# EasyEDA Pro project ProPrj_初级项目_2026-01-11.epro, schematic Schematic2
Board Name: Board2; Create Date: 2025-11-05; Page Name: P1; Project Name: 初级项目; Schematic Name: Schematic2; Update Date: 2025-12-01; Company: 嘉立创EDA; Page Size: A4; Version: V1.0
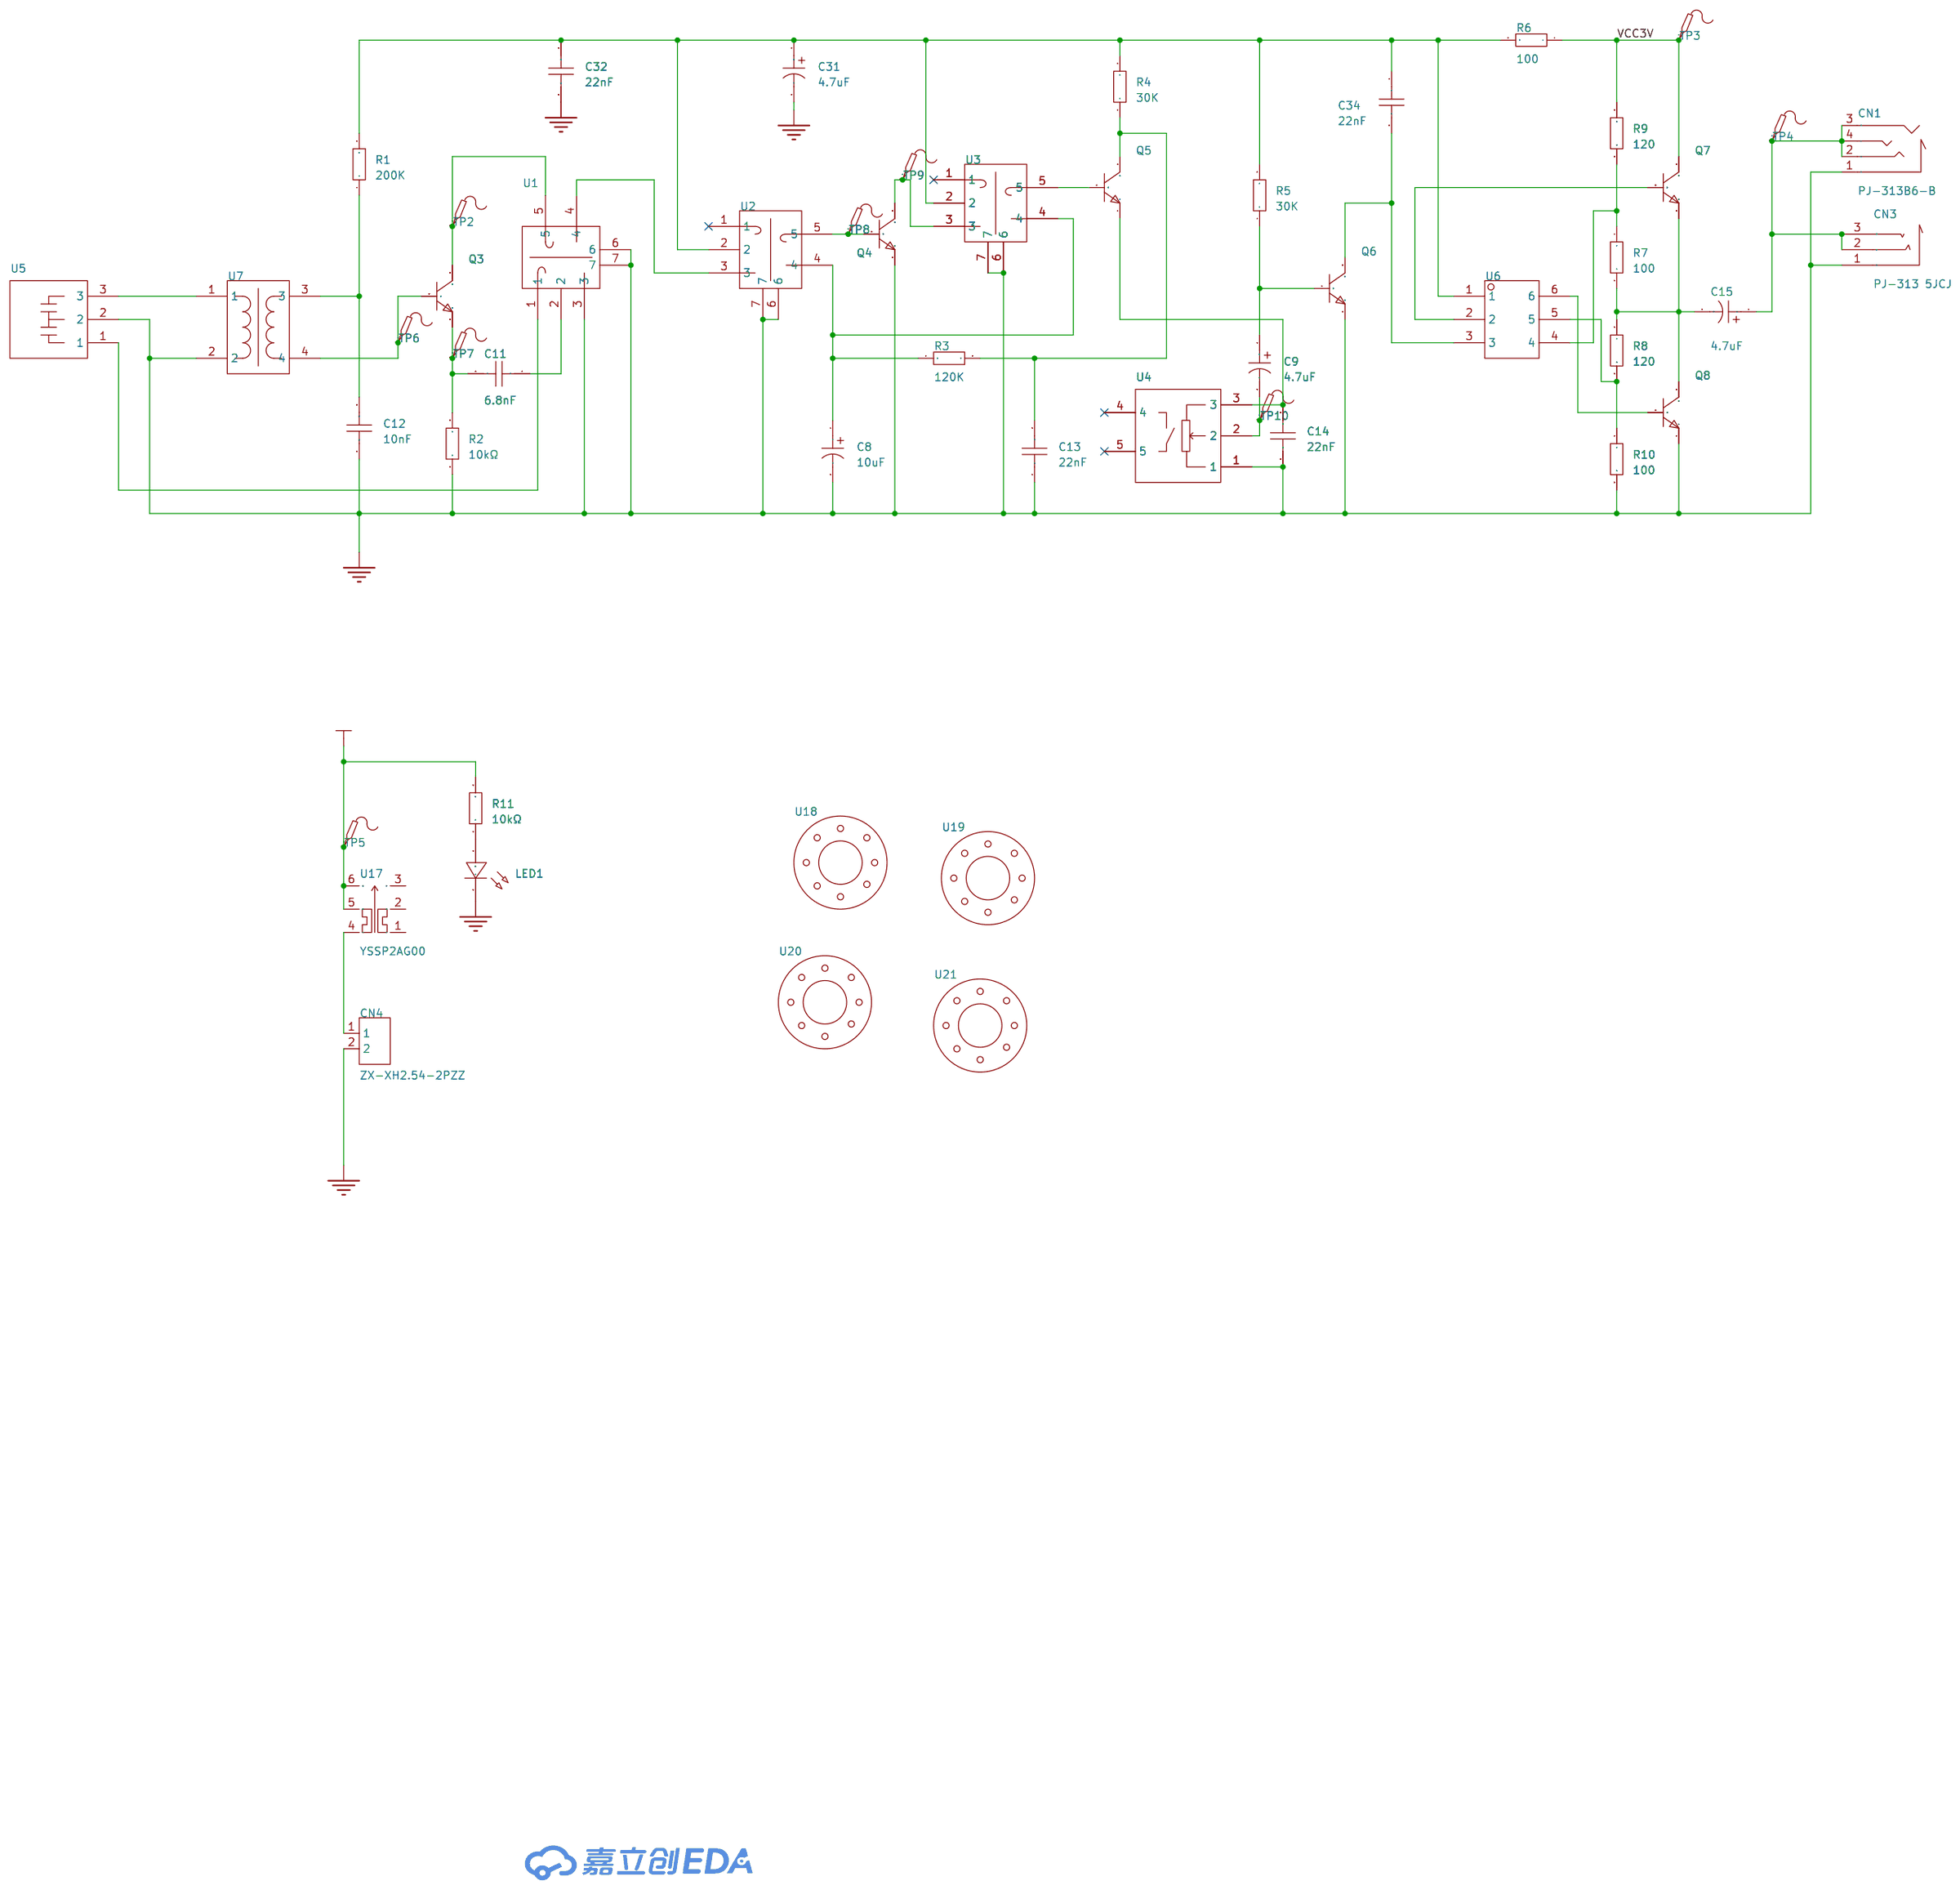
[diagram p3: schematic sheet]

## Parts
C8  10uF  [CAP-TH_BD6.3-P2.50-D0.5-FD]
C9  4.7uF  [CAP-TH_BD8.0-P3.50-D0.5-FD_3]
C11  6.8nF  [CAP-TH_L6.3-W2.6-P5.08-D0.5]
C12  10nF  [CAP-TH_L6.3-W2.6-P5.08-D0.5]
C13  22nF  [CAP-TH_L6.3-W2.6-P5.08-D0.5]
C14  22nF  [CAP-TH_L6.3-W2.6-P5.08-D0.5]
C15  4.7uF  [CAP-TH_BD8.0-P3.50-D0.5-FD_3]
C31  4.7uF  [CAP-TH_BD8.0-P3.50-D0.5-FD_3]
C32  22nF  [CAP-TH_L6.3-W2.6-P5.08-D0.5]
C34  22nF  [CAP-TH_L6.3-W2.6-P5.08-D0.5]
CN1  PJ-313B6-B  [AUDIO-TH_PJ-313B6-B]
CN3  PJ-313 5JCJ  [AUDIO-TH_PJ-313_5JCJ]
CN4  ZX-XH2.54-2PZZ  [CONN-TH_2P-P2.50_HX25003-2A]
LED1  -  [LED_TH-3mm]
Q3  -  [S8050_TO_92]
Q4  -  [S8050_TO_92]
Q5  -  [S8050_TO_92]
Q6  -  [S8050_TO_92]
Q7  -  [S8050_TO_92]
Q8  -  [S8050_TO_92]
R1  200K  [Res_1/8W]
R2  10kΩ  [Res_1/8W]
R3  120K  [Res_1/8W]
R4  30K  [Res_1/8W]
R5  30K  [Res_1/8W]
R6  100  [Res_1/8W]
R7  100  [Res_1/8W]
R8  120  [Res_1/8W]
R9  120  [Res_1/8W]
R10  100  [Res_1/8W]
R11  10kΩ  [Res_1/8W]
TP2  -  [Test-Point-0.5mm]
TP3  -  [Test-Point-0.5mm]
TP4  -  [Test-Point-0.5mm]
TP5  -  [Test-Point-0.5mm]
TP6  -  [Test-Point-0.5mm]
TP7  -  [Test-Point-0.5mm]
TP8  -  [Test-Point-0.5mm]
TP9  -  [Test-Point-0.5mm]
TP10  -  [Test-Point-0.5mm]
U1  -  [白色中周电感]
U2  -  [白色中周电感]
U3  -  [白色中周电感]
U4  -  [旋转电位器]
U5  -  [可变电容]
U6  -  [蓝色变压器]
U7  -  [天线变压器]
U17  YSSP2AG00  [SW-SMD_YSSP2AG00]
U18  -  [固定孔]
U19  -  [固定孔]
U20  -  [固定孔]
U21  -  [固定孔]

## Library data of the parts
C8 = DHG063M106E110S1AA: 容值:10uF;精度:±20%;额定电压:63V;纹波电流:165mA@100kHz;等效串联电阻(ESR):880mΩ@100kHz;; LCSC Part Name: 10uF ±20% 63V; Supplier Part: C49309242; Manufacturer: KNSCHA(科尼盛); Supplier Footprint: 插件,D6.3xL11mm; JLCPCB Part Class: 扩展库; Datasheet: https://item.szlcsc.com/datasheet/DHG063M106E110S1AA/51779124.html; Supplier: LCSC; Tolerance: ±20%; Voltage Rating: 63V; Ripple Current: 165mA@100kHz; Equivalent Series Resistance(ESR): 880mΩ@100kHz; Pin Spacing: 2.5mm; Diameter: 6.3mm; Height - Seated (Max): 11mm; Lifetime: 2000hrs@105℃; Operating Temperature: -40℃~+105℃
C9 C15 C31 = ERG400V4R7M8X10: 容值:4.7uF;精度:±20%;额定电压:400V;等效串联电阻(ESR):12.5Ω@100KHz;; LCSC Part Name: 4.7uF ±20% 400V; Supplier Part: C51904440; Manufacturer: JIERR(捷而瑞); Supplier Footprint: 插件,D8xL10mm; JLCPCB Part Class: 扩展库; Datasheet: https://item.szlcsc.com/datasheet/ERG400V4R7M8X10/54596809.html; Supplier: LCSC; Tolerance: ±20%; Voltage Rating: 400V; Equivalent Series Resistance(ESR): 12.5Ω@100KHz; Diameter: 8mm; Height - Seated (Max): 10mm; Operating Temperature: -25℃~+105℃
C11-C14 C32 C34 = CC1H101JC14DSL6B1100: 容值:100pF;精度:±5%;额定电压:50V;; LCSC Part Name: 100pF ±5% 50V; Supplier Part: C37323966; Manufacturer: Dersonic(德尔创); Supplier Footprint: 插件,P=5.08mm; JLCPCB Part Class: 扩展库; Datasheet: https://item.szlcsc.com/datasheet/CC1H101JC14DSL6B1100/39053442.html; Supplier: LCSC; Tolerance: ±5%; Voltage Rating: 50V
CN1 = PJ-313B6-B: 连接器类型:3.5mm耳机座;额定电流:500mA;额定电压:30V;工作温度:-20℃~+70℃;; LCSC Part Name: 黑色 3.5mm耳机座; Supplier Part: C500087; Manufacturer: XKB Connection(中国星坤); Supplier Footprint: 插件; JLCPCB Part Class: 扩展库; Datasheet: https://item.szlcsc.com/datasheet/PJ-313B6-B/512213.html; Supplier: LCSC; Connector Type: 3.5mm耳机座; Current Rating: 500mA; Voltage Rating (Max): 30V; Operating Temperature: -20℃~+70℃
CN3 = PJ-313 5JCJ: 连接器类型:3.5mm耳机座;额定电流:500mA;额定电压:30V;触头材质:-;触头镀层:银;工作温度:-20℃~+70℃;; LCSC Part Name: 3.5mm耳机座; Supplier Part: C668607; Manufacturer: SHOU HAN(首韩); Supplier Footprint: 插件; JLCPCB Part Class: 扩展库; Datasheet: https://item.szlcsc.com/datasheet/PJ-313%25205JCJ/698550.html; Supplier: LCSC; Connector Type: 3.5mm耳机座; Current Rating: 500mA; Voltage Rating (Max): 30V; Contact Plating: 银; Operating Temperature: -20℃~+70℃
CN4 = ZX-XH2.54-2PZZ: 插针结构:1x2P;间距:2.5mm;安装方式:直插;参考系列:XH;总PIN数:2P;排数:1;每排PIN数:2;行距:-;额定电流:2A;触头材质:黄铜;触头镀层:锡;工作温度:-25℃~+85℃;; LCSC Part Name: 1x2P 间距:2.5mm 直插 系列:XH; Supplier Part: C7429632; Manufacturer: Megastar(兆星); Supplier Footprint: 插件,P=2.5mm; Datasheet: https://item.szlcsc.com/datasheet/ZX-XH2.54-2PZZ/8427549.html; Supplier: LCSC; Pins Structure: 1x2P; Pitch: 2.5mm; Mounting Type: 直插; Reference Series: XH; Number of Pins: 2P; Number of Rows: 1; Number of PINs Per Row: 2; Current Rating: 2A; Contact Material: 黄铜; Contact Plating: 锡; Operating Temperature: -25℃~+85℃; Voltage Rating: 250V; Plastic Material: PA66; Flame Retardant Rating: UL94V-0; Color: 白色; Z-Height of the Board: 7mm; X-Length of Bottom Edge on Board (Spacing Line): 7.5mm; Y-Width of Bottom Edge on Board: 5.9mm
LED1 = LED_TH-R_3mm: Supplier Footprint: 插件
Q3-Q8 = S8050_TO_NPN: Supplier Footprint: TO-92
R1-R11 = Res_AXIAL-1/8W: Supplier Footprint: 轴向引线
TP2-TP10 = Test-Point: Test Point 测试点
U1-U3 = 白色中周电感
U4 = 旋转电位器
U5 = 可变电容
U6 = 蓝色变压器
U7 = 天线变压器
U17 = YSSP2AG00: LCSC Part Name: 9x3.6 正按6脚贴片滑动开关; Supplier Part: C5188558; Manufacturer: YIYUAN(怡远); Supplier Footprint: SMD; JLCPCB Part Class: 扩展库; Datasheet: https://atta.szlcsc.com/upload/public/pdf/source/20221011/AF6FF47B5A85181594B051FD518E9363.pdf; Supplier: LCSC
U18-U21 = 固定孔

## Nets
GND: C8.2 C12.1 C13.1 C14.1 C31.2 C32.2 CN1.1 CN3.1 CN4.2 LED1.2(A) Q4.1(E) Q6.1(E) Q8.1(E) R2.1 R10.2 U1.3 U1.6 U1.7 U2.6 U2.7 U3.6 U3.7 U4.1 U5.2 U7.2
VCC3V: Q7.3(C) R6.1 R9.1 R11.2 TP3.1 TP5.1 U17.5 U17.6
$1N522: C12.2 R1.1 U7.3
$1N636: C11.2 Q3.1(E) R2.2 TP7.1
$1N689: U5.3 U7.1
$1N786: Q3.3(C) TP2.1 U1.5
$1N792: C11.1 U1.2
$1N797: U1.1 U5.1
$1N848: U1.4 U2.3
$1N916: Q4.2(B) TP8.1 U2.5
$1N1155: C31.1 C32.1 C34.1 R1.2 R4.2 R5.2 R6.2 U2.2 U3.2 U6.1
$1N1208: C8.1 R3.1 U2.4 U3.4
$1N1326: Q5.2(B) U3.5
$1N1392: C13.2 Q5.3(C) R3.2 R4.1
$1N1897: C14.2 Q5.1(E) U4.3
$1N1955: C9.2 TP10.1 U4.2
$1N2056: C9.1 Q6.2(B) R5.1
$1N2264: C34.2 Q6.3(C) U6.3
$1N2871: C15.2 Q7.1(E) Q8.3(C) R7.2 R8.1
$1N2875: Q7.2(B) U6.2
$1N2990: R7.1 R9.2 U6.4
$1N3009: Q8.2(B) U6.6
$1N3161: R8.2 R10.1 U6.5
$1N4036: C15.1 CN1.2 CN1.3 CN1.4 CN3.2 CN3.3 TP4.1
$1N4900: Q4.3(C) TP9.1 U3.3
$1N4979: Q3.2(B) TP6.1 U7.4
$1N9264: LED1.1(C) R11.1
$1N9795: CN4.1 U17.4

Not connected (* = marked no-connect by the designer): U2 1*; U3 1*; U4 4* 5*; U17 1 2 3
